# Altium schematic sheet Hole1.SchDoc
size A
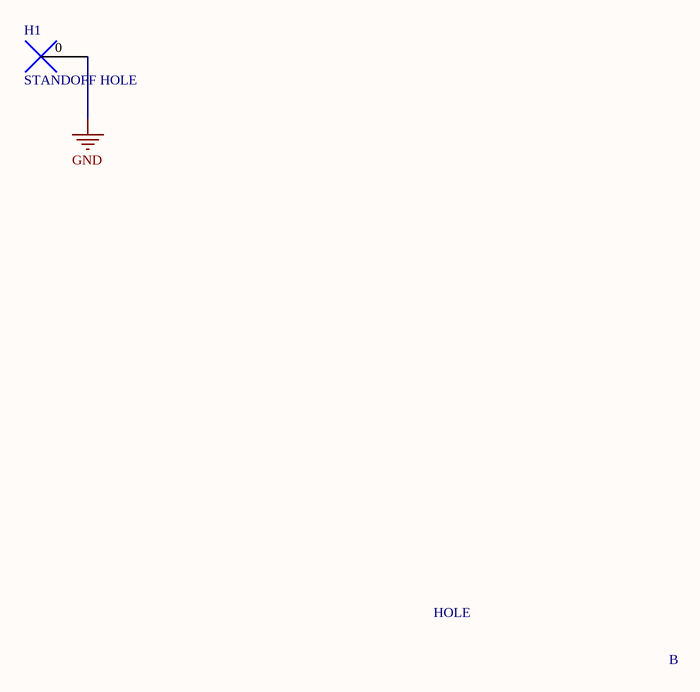
[diagram p0: Hole1.SchDoc]

## Parts
H1  STANDOFF HOLE  [HOLE_3.5MM]

## Nets
GND: H1.0

## Notes on the sheet
- HOLE
- B